# EAGLE design sc_v0 (EAGLE 6.0)
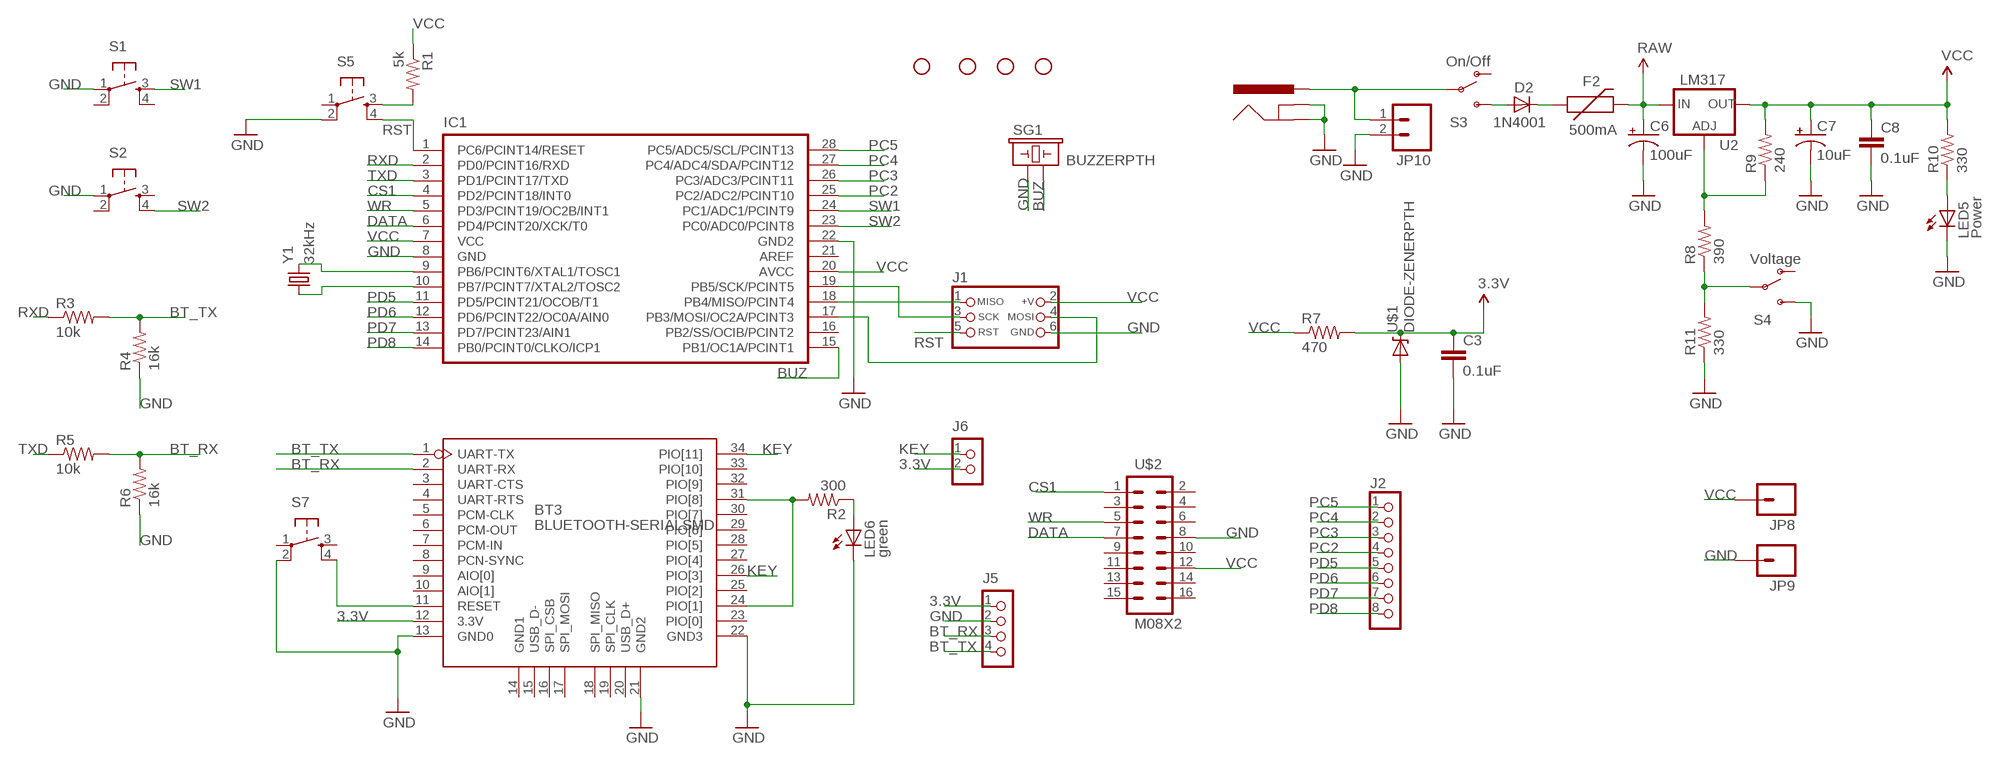
[diagram p0: schematic, sheet 1]

## Parts
BT3  BLUETOOTH-SERIALSMD  [SERIAL_BLUETEETH]
C3  0.1uF  CAPPTH2  [CAP-PTH-SMALL2]
C6  100uF  CAP_POLPTH1  [CPOL-RADIAL-100UF-25V]
C7  10uF  CAP_POLPTH2  [CPOL-RADIAL-10UF-25V]
C8  0.1uF  CAPPTH2  [CAP-PTH-SMALL2]
D2  1N4001  DIODEPTH  [DIODE-0.4]
F2  500mA  PTCPTH  [PTC]
IC1  IC_UC_ATMEGA328PDIL  [DIL28-N]
J1  CON_HEADER_PRG_AVR_ICSP  [HEADER_PRG_2X03]
J2  CON_HEADER_1X08-PTH  [M1X8]
J3  POWER_JACKPTH  [POWER_JACK_PTH]
J5  CON_HEADER_1X04  [M1X4]
J6  CON_HEADER_1X02-PTH  [M1X2]
JP1  STAND-OFF  [STAND-OFF]
JP2  STAND-OFF  [STAND-OFF]
JP3  STAND-OFF  [STAND-OFF]
JP4  STAND-OFF  [STAND-OFF]
JP8  M01PTH  [1X01]
JP9  M01PTH  [1X01]
JP10  M02PTH  [1X02]
LED5  Power  LED5MM  [LED5MM]
LED6  green  LED3MM  [LED3MM]
R1  5k  RESISTORAXIAL-0.3  [AXIAL-0.3]
R2  300  RESISTORAXIAL-0.3  [AXIAL-0.3]
R3  10k  RESISTORAXIAL-0.3  [AXIAL-0.3]
R4  16k  RESISTORAXIAL-0.3  [AXIAL-0.3]
R5  10k  RESISTORAXIAL-0.3  [AXIAL-0.3]
R6  16k  RESISTORAXIAL-0.3  [AXIAL-0.3]
R7  470  RESISTORAXIAL-0.3  [AXIAL-0.3]
R8  390  RESISTORAXIAL-0.3  [AXIAL-0.3]
R9  240  RESISTORAXIAL-0.3  [AXIAL-0.3]
R10  330  RESISTORAXIAL-0.3  [AXIAL-0.3]
R11  330  RESISTORAXIAL-0.3  [AXIAL-0.3]
S1  TAC_SWITCHPTH  [TACTILE-PTH]
S2  TAC_SWITCHPTH  [TACTILE-PTH]
S3  On/Off  SWITCH-SPSTPTH  [SWITCH-SPST]
S4  Voltage  SWITCH-SPSTPTH  [SWITCH-SPST]
S5  TAC_SWITCHPTH  [TACTILE-PTH]
S7  TAC_SWITCHPTH  [TACTILE-PTH]
SG1  BUZZERPTH  [BUZZER-12MM]
U2  LM317  V_REG_317SINK  [TO220-ADJ]
U$1  DIODE-ZENERPTH  [DIODE-ZENER]
U$2  M08X2  [2X8]
Y1  32kHz  CRYSTALTC38H  [TC38H]

## Nets
3.3V: BT3.12(3.3V) C3.1 J5.1 J6.2 R7.P$2 U$1.P$1(C)
BT_RX: BT3.2(UART-RX) J5.3 R5.P$2 R6.P$2
BT_TX: BT3.1(UART-TX) J5.4 R3.P$2 R4.P$2
BUZ: IC1.15(PB1/OC1A/PCINT1) SG1.-
CS1: IC1.4(PD2/PCINT18/INT0) U$2.1
DATA: IC1.6(PD4/PCINT20/XCK/T0) U$2.7
GND: BT3.13(GND0) BT3.21(GND2) BT3.22(GND3) C3.2 C6.2(-) C7.2(-) C8.2 IC1.8(GND) IC1.22(GND2) J1.6(GND) J3.GND J3.GNDBREAK J5.2 JP9.1 JP10.2 LED5.K(C) LED6.K(C) R4.P$1 R6.P$1 R11.P$1 S1.1 S2.1 S4.3(S) S5.2 S7.2 SG1.+ U$1.P$2(A) U$2.8
KEY: BT3.26(PIO[3]) BT3.34(PIO[11]) J6.1
N$1: IC1.9(PB6/PCINT6/XTAL1/TOSC1) Y1.2
N$2: IC1.10(PB7/PCINT7/XTAL2/TOSC2) Y1.1
N$3: IC1.18(PB4/MISO/PCINT4) J1.1(MISO)
N$4: IC1.19(PB5/SCK/PCINT5) J1.3(SCK)
N$5: IC1.17(PB3/MOSI/OC2A/PCINT3) J1.4(MOSI)
N$6: R8.P$2 R9.P$1 U2.ADJ
N$7: LED5.A R10.P$1
N$8: BT3.24(PIO[1]) BT3.31(PIO[8]) R2.P$2
N$9: D2.C F2.P$1
N$10: D2.A S3.3(S)
N$11: J3.PWR JP10.1 S3.2(P)
N$12: R8.P$1 R11.P$2 S4.2(P)
N$14: R1.P$2 S5.3
N$20: BT3.11(RESET) S7.4
N$22: LED6.A R2.P$1
PC2: IC1.25(PC2/ADC2/PCINT10) J2.4
PC3: IC1.26(PC3/ADC3/PCINT11) J2.3
PC4: IC1.27(PC4/ADC4/SDA/PCINT12) J2.2
PC5: IC1.28(PC5/ADC5/SCL/PCINT13) J2.1
PD5: IC1.11(PD5/PCINT21/OCOB/T1) J2.5
PD6: IC1.12(PD6/PCINT22/OC0A/AIN0) J2.6
PD7: IC1.13(PD7/PCINT23/AIN1) J2.7
PD8: IC1.14(PB0/PCINT0/CLKO/ICP1) J2.8
RAW: C6.1(+) F2.P$2 U2.IN
RST: IC1.1(PC6/PCINT14/RESET) J1.5(RST) S5.4
RXD: IC1.2(PD0/PCINT16/RXD) R3.P$1
SW1: IC1.24(PC1/ADC1/PCINT9) S1.3
SW2: IC1.23(PC0/ADC0/PCINT8) S2.4
TXD: IC1.3(PD1/PCINT17/TXD) R5.P$1
VCC: C7.1(+) C8.1 IC1.7(VCC) IC1.20(AVCC) J1.2(+V) JP8.1 R1.P$1 R7.P$1 R9.P$2 R10.P$2 U2.OUT U$2.12
WR: IC1.5(PD3/PCINT19/OC2B/INT1) U$2.5
Unconnected: BT3.3(UART-CTS) BT3.4(UART-RTS) BT3.5(PCM-CLK) BT3.6(PCM-OUT) BT3.7(PCM-IN) BT3.8(PCN-SYNC) BT3.9(AIO[0]) BT3.10(AIO[1]) BT3.14(GND1) BT3.15(USB_D-) BT3.16(SPI_CSB) BT3.17(SPI_MOSI) BT3.18(SPI_MISO) BT3.19(SPI_CLK) BT3.20(USB_D+) BT3.23(PIO[0]) BT3.25(PIO[2]) BT3.27(PIO[4]) BT3.28(PIO[5]) BT3.29(PIO[6]) BT3.30(PIO[7]) BT3.32(PIO[9]) BT3.33(PIO[10]) IC1.16(PB2/SS/OCIB/PCINT2) IC1.21(AREF) S1.2 S1.4 S2.2 S2.3 S3.1(O) S4.1(O) S5.1 S7.1 S7.3 U$2.2 U$2.3 U$2.4 U$2.6 U$2.9 U$2.10 U$2.11 U$2.13 U$2.14 U$2.15 U$2.16

## Library data of the parts
BT3 = Module:BLUETOOTH-SERIAL
C3 C8 = SparkFun:CAP: Capacitor Standard 0603 ceramic capacitor, and 0.1" leaded capacitor.
C6 C7 = SparkFun:CAP_POL: Capacitor Polarized These are standard SMD and PTH capacitors. Normally 10uF, 47uF, and 100uF in electrolytic and tantalum varieties. Always verify the external diameter of the through hole cap, it varies with capacity, voltage, and manufacturer. The EIA devices should be standard.
D2 = SparkFun:DIODE: Diode These are standard reverse protection diodes and small signal diodes. SMA package can handle up to about 1A. SOD-323 can handle about 200mA. What the SOD-323 package when ordering, there are some mfgs out there that are 5-pin packages.
F2 = SparkFun:PTC: Resettable Fuse PTC Resettable Fuse. Spark Fun Electronics SKU : COM-08357
IC1 = dp_devices:IC_UC_ATMEGA328P
J1 = dp_devices:CON_HEADER_PRG_AVR_ICSP: 2x3 AVR ICSP programming header
J2 = dp_devices:CON_HEADER_1X08
J3 = SparkFun:POWER_JACK: Power Jack This is the standard 5.5mm barrel jack for power. The PTH is the most common, proven, reliable, footprint. All others are experimental. The Slot footprint only works if the mill layer is transmitted to the PCB fab house so be warned. Spark Fun Electronics SKU : PRT-00119. Mating wall wart : TOL-00298 (and others)
J5 = dp_devices:CON_HEADER_1X04
J6 = dp_devices:CON_HEADER_1X02
JP1-JP4 = SparkFun:STAND-OFF: Stand Off This is the mechanical footprint for a #4 phillips button head screw. Use the keepout ring to avoid running the screw head into surrounding components. SKU : PRT-00447
JP8 JP9 = SparkFun:M01: Header 1 Standard 1-pin 0.1" header. Use with straight break away headers (SKU : PRT-00116), right angle break away headers (PRT-00553), swiss pins (PRT-00743), machine pins (PRT-00117), and female headers (PRT-00115).
JP10 = SparkFun:M02: Header 2 Standard 2-pin 0.1" header. Use with straight break away headers (SKU : PRT-00116), right angle break away headers (PRT-00553), swiss pins (PRT-00743), machine pins (PRT-00117), and female headers (PRT-00115). Molex polarized connector foot print use with SKU : PRT-08233 with associated crimp pins and housings.
LED5 = SparkFun-Nate:LED
LED6 = SparkFun:LED: LEDs Standard schematic elements and footprints for 5mm, 3mm, 1206, and 0603 sized LEDs. 5mm - Spark Fun Electronics SKU : COM-00529 (and others)
R1-R11 = SparkFun:RESISTOR: Resistor Basic schematic elements and footprints for 0603, 1206, and PTH resistors.
S1 S2 S5 S7 = SparkFun:TAC_SWITCH: Momentary Switch Button commonly used for reset or general input. Spark Fun Electronics SKU : COM-00097
S3 S4 = SparkFun:SWITCH-SPST: SPST Switch Simple slide switch. Spark Fun Electronics SKU : COM-00102
SG1 = SparkFun:BUZZER: Buzzer 12mm Spark Fun Electronics SKU : Comp-Buzzer
U2 = SparkFun:V_REG_317: Voltage Regulator Standard LM317 adjustable voltage regulator. AOI (Adjust Output Input). Google 'LM317 Calculator' for easy to use app to get the two resistor values needed. 240/720 for 5V output. 240/390 for 3.3V output. Spark Fun Electronics SKU : COM-00527
U$1 = SparkFun:DIODE-ZENER: Zener Diode Production Part - 8199 3.4V Zener Voltage
U$2 = SparkFun:M08X2
Y1 = SparkFun:CRYSTAL: Crystals Various standard crystals. Proven footprints. Spark Fun Electronics SKU : COM-00534

## Net classes
0 default: width 0.003 mm, drill 0.254 mm, clearance 0.152 mm

## Board
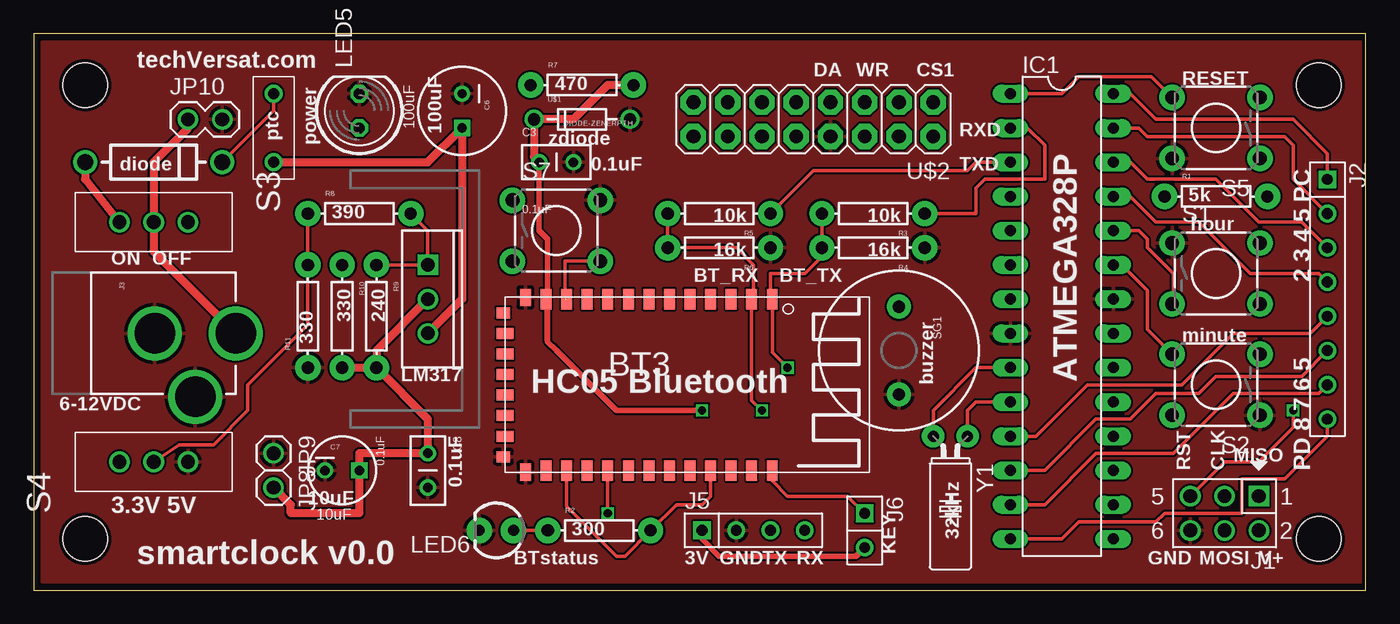
[diagram p1: board, top side]
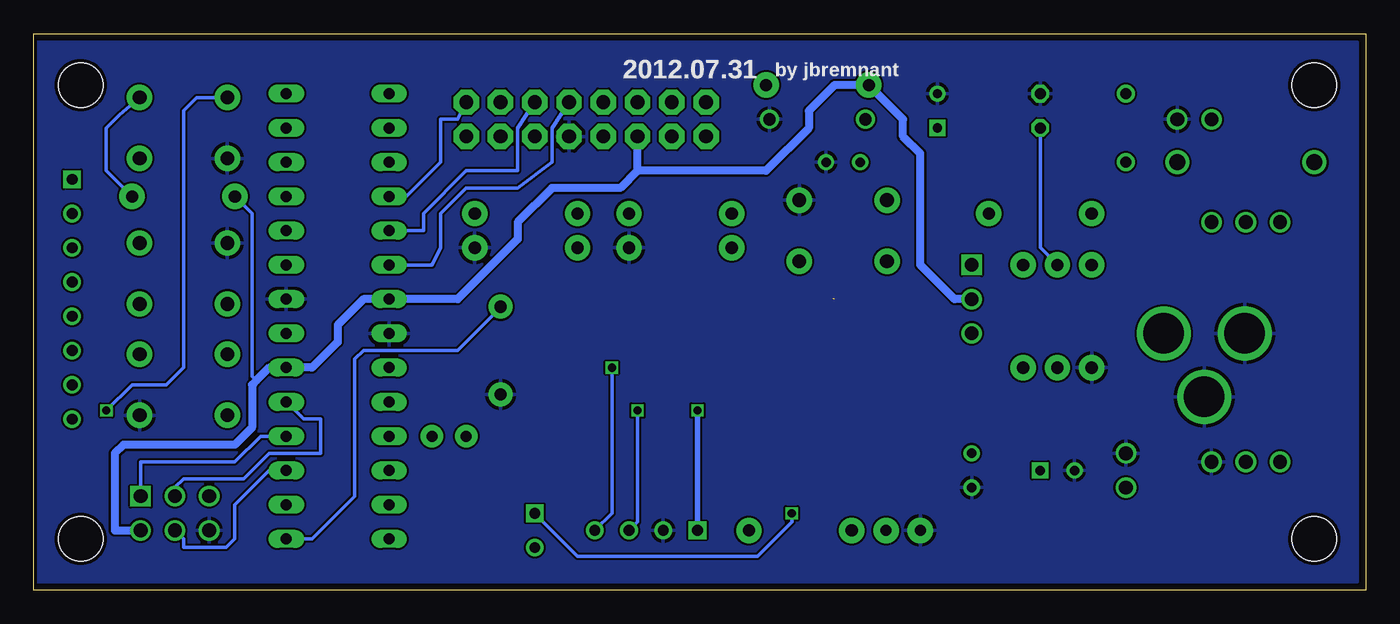
[diagram p2: board, bottom side, seen from below]

Size 98.73 x 41.25 mm. Coordinates in mm from the lower left corner, seen from the top.
Outline: 0,41.25 0,0 98.73,0 98.73,41.25 0,41.25
Copper layers (1*16): Top 0.035mm / dielectric 1.5mm / Bottom 0.035mm
Design rules: minimum track width 6mil, minimum drill 12mil, track to track 6mil, track to pad 6mil, pad to pad 6mil, via to via 6mil, smd to smd 0mil, copper to edge 10mil, drill to drill 10mil, minimum pad ring 10mil, minimum via ring 6mil, stop-mask expansion 2mil, vias tented up to drill 100mil, thermal gap 10mil

### Footprints (pad centres in the part's own frame; a part is rotated, then mirrored left to right if it is on the bottom)
SERIAL_BLUETEETH = smd 1.524 x 0.813: 1 -6.35,19.812; 2 -6.35,18.288; 3 -6.35,16.764; 4 -6.35,15.24; 5 -6.35,13.716; 6 -6.35,12.192; 7 -6.35,10.668; 8 -6.35,9.144; 9 -6.35,7.62; 10 -6.35,6.096; 11 -6.35,4.572; 12 -6.35,3.048; 23 6.35,3.048; 24 6.35,4.572; 25 6.35,6.096; 26 6.35,7.62; 27 6.35,9.144; 28 6.35,10.668; 29 6.35,12.192; 30 6.35,13.716; 31 6.35,15.24; 32 6.35,16.764; 33 6.35,18.288; 34 6.35,19.812 | smd 1.27 x 0.813: 13 -6.477,1.524; 22 6.477,1.524 | smd 0.813 x 1.016: 14 -5.334,-0.127; 21 5.334,-0.127 | smd 0.813 x 1.27: 15 -3.81,0; 16 -2.286,0; 17 -0.762,0; 18 0.762,0; 19 2.286,0; 20 3.81,0
CAP-PTH-SMALL2 = drill 0.7: 1 0,0; 2 2.54,0
CPOL-RADIAL-100UF-25V = drill 0.7 square: 1 1.27,0 | drill 0.7: 2 -1.27,0
CPOL-RADIAL-10UF-25V = drill 0.7 square: 1 1.27,0 | drill 0.7: 2 -1.27,0
DIODE-0.4 = drill 1.2: A 0,0; C 10.16,0
PTC = drill 0.8: P$1 -2.54,0; P$2 2.54,0
DIL28-N = drill 0.813 long: 1 -16.51,-3.81; 2 -13.97,-3.81; 3 -11.43,-3.81; 4 -8.89,-3.81; 5 -6.35,-3.81; 6 -3.81,-3.81; 7 -1.27,-3.81; 8 1.27,-3.81; 9 3.81,-3.81; 10 6.35,-3.81; 11 8.89,-3.81; 12 11.43,-3.81; 13 13.97,-3.81; 14 16.51,-3.81; 15 16.51,3.81; 16 13.97,3.81; 17 11.43,3.81; 18 8.89,3.81; 19 6.35,3.81; 20 3.81,3.81; 21 1.27,3.81; 22 -1.27,3.81; 23 -3.81,3.81; 24 -6.35,3.81; 25 -8.89,3.81; 26 -11.43,3.81; 27 -13.97,3.81; 28 -16.51,3.81
HEADER_PRG_2X03 = drill 1.016 square: 1 -2.54,-1.27 | drill 1.016: 2 -2.54,1.27; 3 0,-1.27; 4 0,1.27; 5 2.54,-1.27; 6 2.54,1.27
M1X8 = drill 0.8 square: 1 -8.89,0 | drill 0.8: 2 -6.35,0; 3 -3.81,0; 4 -1.27,0; 5 1.27,0; 6 3.81,0; 7 6.35,0; 8 8.89,0
POWER_JACK_PTH = drill 2.997: GND 0,7.7; GNDBREAK 4.7,10.7; PWR 0,13.7
M1X4 = drill 0.8 square: 1 0,0 | drill 0.8: 2 2.54,0; 3 5.08,0; 4 7.62,0
M1X2 = drill 0.8 square: 1 -1.27,0 | drill 0.8: 2 1.27,0
STAND-OFF = hole 3.302: 0,0
1X01 = drill 1.016: 1 0,0
1X02 = drill 1.016: 1 0,0; 2 2.54,0
LED5MM = drill 0.813 octagon: A -1.27,0; K 1.27,0
LED3MM = drill 0.813 pad 1.88: A -1.27,0; K 1.27,0
AXIAL-0.3 = drill 0.9 pad 1.88: P$1 -3.81,0; P$2 3.81,0
TACTILE-PTH = drill 1.016 pad 1.88: 1 -3.251,2.261; 2 3.251,2.261; 3 -3.251,-2.261; 4 3.251,-2.261
SWITCH-SPST = drill 1.016: 1 0,2.54; 2 0,0; 3 0,-2.54
BUZZER-12MM = drill 0.9 pad 1.778: + 3.25,0; - -3.25,0
TO220-ADJ = drill 1 square: ADJ -2.54,0 | drill 1: IN 2.54,0; OUT 0,0
DIODE-ZENER = drill 0.9: P$1 -3.556,0; P$2 3.556,0
2X8 = drill 1.016 pad 1.88 octagon: 1 0,0; 2 0,2.54; 3 2.54,0; 4 2.54,2.54; 5 5.08,0; 6 5.08,2.54; 7 7.62,0; 8 7.62,2.54; 9 10.16,0; 10 10.16,2.54; 11 12.7,0; 12 12.7,2.54; 13 15.24,0; 14 15.24,2.54; 15 17.78,0; 16 17.78,2.54
TC38H = drill 0.813 pad 1.676: 1 -1.27,0; 2 1.27,0

### Placement (x,y rotation side)
BT3  34.92,15.22 270 top
C3  37.47,31.73 0 top
C6  31.75,35.54 270 top
C7  22.86,8.87 0 top
C8  29.21,10.14 270 top
D2  3.81,31.73 0 top
F2  17.78,34.27 270 top
IC1  76.2,20.3 270 top
J1  88.27,5.7 180 top
J2  95.89,21.57 270 top
J3  1.27,19.03 270 top
J5  49.53,4.43 0 top
J6  61.59,4.43 270 top
JP1  3.81,3.79 0 top
JP2  3.81,37.45 0 top
JP3  95.25,37.45 0 top
JP4  95.25,3.79 0 top
JP8  17.78,7.6 270 top
JP9  17.78,10.14 270 top
JP10  11.43,34.9 0 top
LED5  24.13,35.54 90 top
LED6  34.29,4.43 180 top
R1  87.63,29.19 0 top
R2  41.91,4.43 0 top
R3  62.23,27.92 180 top
R4  62.23,25.38 180 top
R5  50.8,27.92 180 top
R6  50.8,25.38 180 top
R7  40.64,37.45 0 top
R8  24.13,27.92 0 top
R9  25.4,20.3 270 top
R10  22.86,20.3 270 top
R11  20.32,20.3 90 top
S1  87.63,23.48 0 top
S2  87.63,15.22 180 top
S3  8.89,27.29 270 top
S4  8.89,9.51 90 top
S5  87.63,34.27 180 top
S7  38.73,26.65 0 top
SG1  64.14,17.76 270 top
U2  29.21,21.57 270 top
U$1  40.64,34.9 0 top
U$2  66.67,36.17 180 top
Y1  67.94,11.41 180 top

### Tracks (layer width: path | path; a pad name or v marks a point on that pad's centre or on a via)
3.3V  (via drill 0.6)
  Top 0.254: BT3.12 37.97,18.52 38.73,17.76
  Top 0.406: C3.1 37.47,26.65 38.1,26.02 38.1,18.39 38.73,17.76 43.18,13.32 v49.53,13.32 | J5.1 49.53,3.79 50.8,2.52 60.96,2.52 J6.2
  Top 0.61: R7.P$2 42.55,37.45 40.01,34.9 U$1.P$1 37.08,32.11 C3.1
  Bottom 0.406: v49.53,13.32 J5.1
BT_RX  (via drill 0.6)
  Top 0.254: R5.P$2 R6.P$2 52.07,25.38 53.34,24.11 53.34,21.7 BT3.2 53.21,14.08 v53.98,13.32
  Bottom 0.254: v53.98,13.32 53.98,5.06 J5.3
BT_TX  (via drill 0.6)
  Top 0.254: R3.P$2 R4.P$2 58.42,24.75 57.15,23.48 54.61,23.48 54.61,21.7 BT3.1 54.74,17.63 v55.88,16.49
  Bottom 0.254: v55.88,16.49 55.88,5.7 J5.4
BUZ
  Bottom 0.254: IC1.15 78.11,3.79 74.93,6.97 74.93,17.12 74.3,17.76 67.31,17.76 64.14,20.93 SG1.-
CS1
  Bottom 0.254: IC1.4 71.12,29.19 68.58,31.73 68.58,34.9 67.31,34.9 U$2.1
DATA
  Bottom 0.254: IC1.6 69.22,24.11 68.58,25.38 68.58,27.92 66.67,29.82 62.87,29.82 60.33,31.73 60.33,34.27 U$2.7
GND
  pour Top: 0.64,40.62 98.42,40.62 98.42,0.61 0.64,0.61
  pour Bottom: 0.64,40.62 98.42,40.62 98.42,0.61 0.64,0.61
KEY  (via drill 0.6)
  Top 0.254: BT3.34 54.74,8.11 55.88,6.97 60.33,6.97 J6.1 | BT3.26 v42.55,5.7
  Bottom 0.254: v42.55,5.7 42.55,5.06 45.09,2.52 58.42,2.52 J6.1
N$1
  Top 0.254: IC1.9 69.85,16.49 66.67,13.32 Y1.2
N$2
  Top 0.254: IC1.10 69.85,13.95 69.22,13.32 Y1.1
N$3
  Bottom 0.254: J1.1 90.81,9.51 83.82,9.51 81.92,11.41 IC1.18
N$4
  Bottom 0.254: J1.3 88.27,7.6 87.63,8.24 83.19,8.24 81.28,10.14 77.47,10.14 77.47,12.68 78.74,12.68 IC1.19
N$5
  Bottom 0.254: IC1.17 81.28,8.87 83.82,6.33 83.82,3.79 84.45,3.15 87.63,3.15 87.63,3.79 J1.4
N$6
  Top 0.254: R9.P$1 U2.ADJ 29.21,26.65 R8.P$2
N$7
  Bottom 0.254: LED5.A 24.13,25.38 R10.P$1
N$8
  Top 0.254: BT3.24 39.5,6.2 43.18,2.52 43.81,2.52 R2.P$2 47.62,6.33 49.53,6.33 50.16,6.97 BT3.31
N$9
  Top 0.254: F2.P$1 17.78,35.54 D2.C
N$10
  Top 0.61: D2.A 3.81,30.46 S3.3
N$11
  Top 0.61: J3.PWR 8.89,25.11 S3.2 8.89,31.73 11.43,34.27 JP10.1
N$12
  Top 0.254: R8.P$1 R11.P$2 20.32,19.66 15.88,15.22 15.88,13.32 13.34,10.78 10.79,10.78 S4.2
N$14
  Bottom 0.254: S5.3 92.35,35.26 93.34,34.27 93.34,31.09 R1.P$2
N$20  (1 unrouted)
  Top 0.254: S7.4 39.37,24.39 39.37,21.57
N$22
  Top 0.254: LED6.A R2.P$1
PC2
  Top 0.254: IC1.25 81.28,29.19 83.19,27.29 86.36,27.29 90.17,23.48 95.25,23.48 J2.4
PC3
  Top 0.254: IC1.26 81.28,31.73 82.55,30.46 87.63,30.46 90.81,27.29 93.98,27.29 J2.3
PC4
  Top 0.254: IC1.27 81.92,34.27 82.55,33.63 92.71,33.63 93.34,33 93.34,30.46 J2.2
PC5
  Top 0.254: IC1.28 81.28,36.81 83.19,34.9 93.34,34.9 95.89,32.36 J2.1
PD5
  Top 0.254: IC1.11 74.3,11.41 78.11,15.22 85.09,15.22 88.9,19.03 94.61,19.03 J2.5
PD6
  Top 0.254: IC1.12 74.93,8.87 78.74,12.68 81.28,12.68 83.19,14.59 86.36,14.59 87.63,15.86 93.98,15.86 J2.6
PD7
  Top 0.254: IC1.13 74.93,6.33 78.74,10.14 84.45,10.14 88.9,14.59 95.25,14.59 J2.7
PD8
  Top 0.254: IC1.14 76.2,3.79 77.47,5.06 83.19,5.06 83.82,5.7 89.53,5.7 89.53,8.24 92.71,8.24 95.89,11.41 J2.8
RAW
  Top 0.61: F2.P$2 29.21,31.73 C6.1 31.75,21.57 U2.IN
RST  (via drill 0.6)
  Top 0.254: IC1.1 76.2,36.81 77.47,38.08 82.83,38.08 S5.4 | v93.34,13.32 93.34,12.04 90.81,9.51 88.27,9.51 J1.5
  Bottom 0.254: S5.4 86.64,36.53 87.63,35.54 87.63,16.49 88.9,15.22 91.44,15.22 v93.34,13.32
RXD
  Top 0.254: IC1.2 73.66,34.27 74.93,33 74.93,30.46 70.48,30.46 69.85,29.82 69.85,27.92 R3.P$1
SW1
  Top 0.254: IC1.24 81.92,26.65 82.55,26.02 82.55,25.38 84.45,23.48 84.45,21.29 S1.3
SW2
  Top 0.254: IC1.23 80.64,24.11 82.55,22.21 82.55,19.31 S2.4
TXD
  Top 0.254: IC1.3 69.85,31.73 69.22,31.09 57.78,31.09 R5.P$1
VCC
  Top 0.61: U2.OUT 25.4,17.76 R9.P$2 | R9.P$2 29.21,12.68 C8.1 24.13,10.14 C7.1 24.13,5.7 19.05,5.7 19.05,6.33 JP8.1 | R10.P$2 R9.P$2
  Bottom 0.254: R1.P$1 82.55,27.92 82.55,15.86 82.23,15.54
  Bottom 0.61: U2.OUT 30.48,21.57 33.02,24.11 33.02,32.36 34.29,33.63 34.29,34.9 R7.P$1 39.37,37.45 41.27,35.54 41.27,34.27 44.45,31.09 53.98,31.09 | 53.98,31.09 U$2.12 | 53.98,31.09 55.24,29.82 60.33,29.82 62.87,27.29 62.87,26.02 67.31,21.57 IC1.7 74.3,21.57 76.2,19.66 76.2,18.39 78.11,16.49 IC1.20 81.28,16.49 82.23,15.54 82.55,15.22 82.55,12.04 83.82,10.78 92.08,10.78 92.71,10.14 92.71,4.43 J1.2
WR
  Bottom 0.254: IC1.5 69.85,26.65 69.85,27.92 66.67,31.09 62.87,31.09 62.87,34.27 U$2.5

### Text on the board
tPlace: techVersat.com | 100uF | DA | WR | CS1 | RESET | ptc | RXD | power | zdiode | ATMEGA328P | diode | 0.1uF | TXD | hour | ON OFF | BT_RX | BT_TX | 2 3 4 5 PC | minute | LM317 | HC05 Bluetooth | buzzer | 6-12VDC | MISO | RST | CLK | PD 8 7 6 5 | 0.1uF | 3.3V 5V | 10uF | KEY | 32kHz | smartclock v0.0 | BTstatus | 3V | GND | TX | RX | GND | MOSI | V+
bPlace: 2012.07.31 | by jbremnant